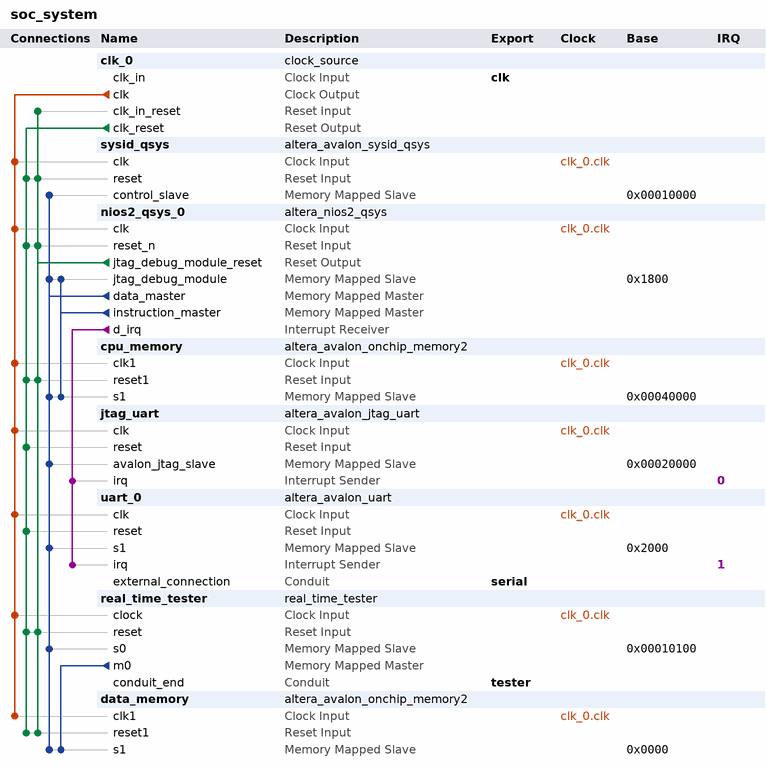
[diagram p0: system contents]
# Platform Designer (Qsys) system soc_system, Cyclone V 5CSXFC6D6F31C8ES
# Parameters at their usual value, and those the tool derives, are not listed.
package require -exact qsys 14.0
create_system soc_system
set_project_property DEVICE_FAMILY {Cyclone V}
set_project_property DEVICE 5CSXFC6D6F31C8ES

add_instance clk_0 clock_source 14.0
set_instance_parameter_value clk_0 clockFrequency 50000000

add_instance sysid_qsys altera_avalon_sysid_qsys 14.0
set_instance_parameter_value sysid_qsys id -1395322110

add_instance nios2_qsys_0 altera_nios2_qsys 14.0
set_instance_parameter_value nios2_qsys_0 resetrequest_enabled true
set_instance_parameter_value nios2_qsys_0 resetSlave cpu_memory.s1
set_instance_parameter_value nios2_qsys_0 mmu_TLBMissExcSlave None
set_instance_parameter_value nios2_qsys_0 exceptionSlave cpu_memory.s1
set_instance_parameter_value nios2_qsys_0 breakSlave nios2_qsys_0.jtag_debug_module
set_instance_parameter_value nios2_qsys_0 impl Tiny
set_instance_parameter_value nios2_qsys_0 icache_size 4096

add_instance cpu_memory altera_avalon_onchip_memory2 14.0
set_instance_parameter_value cpu_memory dataWidth 32
set_instance_parameter_value cpu_memory dualPort false
set_instance_parameter_value cpu_memory initMemContent true
set_instance_parameter_value cpu_memory initializationFileName onchip_mem.hex
set_instance_parameter_value cpu_memory memorySize 40960

add_instance jtag_uart altera_avalon_jtag_uart 14.0
set_instance_parameter_value jtag_uart allowMultipleConnections true
set_instance_parameter_value jtag_uart simInteractiveOptions INTERACTIVE_ASCII_OUTPUT

add_instance uart_0 altera_avalon_uart 14.0
set_instance_parameter_value uart_0 baud 9600
set_instance_parameter_value uart_0 dataBits 8
set_instance_parameter_value uart_0 fixedBaud false
set_instance_parameter_value uart_0 parity NONE
set_instance_parameter_value uart_0 stopBits 1

add_instance real_time_tester real_time_tester 2.0
set_instance_parameter_value real_time_tester M0_DATA_WIDTH 64
set_instance_parameter_value real_time_tester M0_ADDR_WIDTH 32
set_instance_parameter_value real_time_tester M0_BURST_START 8
set_instance_parameter_value real_time_tester M0_BURST_START_REG_WIDTH 4

add_instance data_memory altera_avalon_onchip_memory2 14.0
set_instance_parameter_value data_memory dataWidth 64
set_instance_parameter_value data_memory dualPort false
set_instance_parameter_value data_memory initMemContent true
set_instance_parameter_value data_memory initializationFileName onchip_mem.hex
set_instance_parameter_value data_memory memorySize 4096

# connections
add_connection clk_0.clk cpu_memory.clk1 clock
add_connection clk_0.clk data_memory.clk1 clock
add_connection clk_0.clk jtag_uart.clk clock
add_connection clk_0.clk nios2_qsys_0.clk clock
add_connection clk_0.clk real_time_tester.clock clock
add_connection clk_0.clk sysid_qsys.clk clock
add_connection clk_0.clk uart_0.clk clock
add_connection clk_0.clk_reset cpu_memory.reset1 reset
add_connection clk_0.clk_reset data_memory.reset1 reset
add_connection clk_0.clk_reset jtag_uart.reset reset
add_connection clk_0.clk_reset nios2_qsys_0.reset_n reset
add_connection clk_0.clk_reset real_time_tester.reset reset
add_connection clk_0.clk_reset sysid_qsys.reset reset
add_connection clk_0.clk_reset uart_0.reset reset
add_connection nios2_qsys_0.jtag_debug_module_reset clk_0.clk_in_reset reset
add_connection nios2_qsys_0.jtag_debug_module_reset cpu_memory.reset1 reset
add_connection nios2_qsys_0.jtag_debug_module_reset data_memory.reset1 reset
add_connection nios2_qsys_0.jtag_debug_module_reset nios2_qsys_0.reset_n reset
add_connection nios2_qsys_0.jtag_debug_module_reset real_time_tester.reset reset
add_connection nios2_qsys_0.jtag_debug_module_reset sysid_qsys.reset reset
add_connection nios2_qsys_0.data_master cpu_memory.s1 avalon
set_connection_parameter_value nios2_qsys_0.data_master/cpu_memory.s1 baseAddress 0x00040000
add_connection nios2_qsys_0.data_master data_memory.s1 avalon
set_connection_parameter_value nios2_qsys_0.data_master/data_memory.s1 baseAddress 0x0000
add_connection nios2_qsys_0.data_master jtag_uart.avalon_jtag_slave avalon
set_connection_parameter_value nios2_qsys_0.data_master/jtag_uart.avalon_jtag_slave baseAddress 0x00020000
add_connection nios2_qsys_0.data_master nios2_qsys_0.jtag_debug_module avalon
set_connection_parameter_value nios2_qsys_0.data_master/nios2_qsys_0.jtag_debug_module baseAddress 0x1800
add_connection nios2_qsys_0.data_master real_time_tester.s0 avalon
set_connection_parameter_value nios2_qsys_0.data_master/real_time_tester.s0 baseAddress 0x00010100
add_connection nios2_qsys_0.data_master sysid_qsys.control_slave avalon
set_connection_parameter_value nios2_qsys_0.data_master/sysid_qsys.control_slave baseAddress 0x00010000
add_connection nios2_qsys_0.data_master uart_0.s1 avalon
set_connection_parameter_value nios2_qsys_0.data_master/uart_0.s1 baseAddress 0x2000
add_connection nios2_qsys_0.instruction_master cpu_memory.s1 avalon
set_connection_parameter_value nios2_qsys_0.instruction_master/cpu_memory.s1 baseAddress 0x00040000
add_connection nios2_qsys_0.instruction_master nios2_qsys_0.jtag_debug_module avalon
set_connection_parameter_value nios2_qsys_0.instruction_master/nios2_qsys_0.jtag_debug_module baseAddress 0x1800
add_connection real_time_tester.m0 data_memory.s1 avalon
set_connection_parameter_value real_time_tester.m0/data_memory.s1 baseAddress 0x0000
add_connection nios2_qsys_0.d_irq jtag_uart.irq interrupt
set_connection_parameter_value nios2_qsys_0.d_irq/jtag_uart.irq irqNumber 0
add_connection nios2_qsys_0.d_irq uart_0.irq interrupt
set_connection_parameter_value nios2_qsys_0.d_irq/uart_0.irq irqNumber 1

# exported interfaces
add_interface clk clock sink
set_interface_property clk EXPORT_OF clk_0.clk_in
add_interface tester conduit end
set_interface_property tester EXPORT_OF real_time_tester.conduit_end
add_interface serial conduit end
set_interface_property serial EXPORT_OF uart_0.external_connection

set_interconnect_requirement {$system} qsys_mm.clockCrossingAdapter HANDSHAKE
set_interconnect_requirement {$system} qsys_mm.maxAdditionalLatency 1
set_interconnect_requirement {$system} qsys_mm.insertDefaultSlave FALSE
set_interconnect_requirement hps_only_master.master qsys_mm.security SECURE
set_interconnect_requirement custom_module.m0 qsys_mm.security SECURE
set_interconnect_requirement f2sdram_only_master.master qsys_mm.security SECURE
set_interconnect_requirement real_time_tester.m0 qsys_mm.security SECURE
set_interconnect_requirement real_time_tester.s0 qsys_mm.security NON_SECURE

save_system soc_system.qsys
